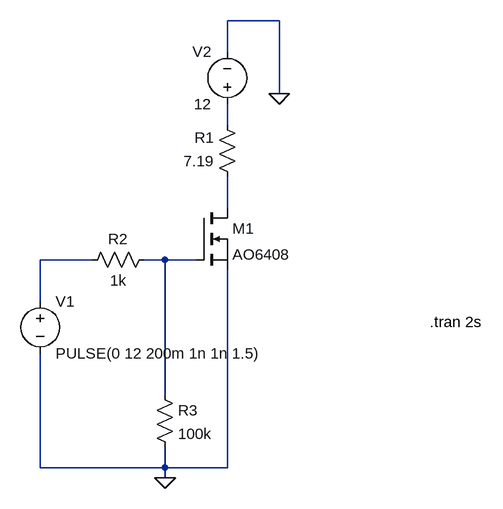
[diagram p0: schematic Valve Controller.asc]
Valve Controller.asc, the LTspice schematic file:
Version 4
SHEET 1 880 680
WIRE 400 -320 320 -320
WIRE 320 -272 320 -320
WIRE 400 -208 400 -320
WIRE 320 -160 320 -192
WIRE 320 -32 320 -80
WIRE 112 48 32 48
WIRE 224 48 192 48
WIRE 272 48 224 48
WIRE 32 112 32 48
WIRE 224 256 224 48
WIRE 32 368 32 192
WIRE 224 368 224 336
WIRE 224 368 32 368
WIRE 320 368 320 64
WIRE 320 368 224 368
WIRE 224 384 224 368
FLAG 224 384 0
FLAG 400 -208 0
SYMBOL voltage 32 96 R0
WINDOW 123 0 0 Left 0
WINDOW 39 0 0 Left 0
SYMATTR InstName V1
SYMATTR Value PULSE(0 12 200m 1n 1n 1.5)
SYMBOL nmos 272 -32 R0
SYMATTR InstName M1
SYMATTR Value AO6408
SYMBOL res 336 -64 R180
WINDOW 0 36 76 Left 2
WINDOW 3 36 40 Left 2
SYMATTR InstName R1
SYMATTR Value 7.19
SYMBOL res 208 32 R90
WINDOW 0 0 56 VBottom 2
WINDOW 3 32 56 VTop 2
SYMATTR InstName R2
SYMATTR Value 1k
SYMBOL res 208 240 R0
SYMATTR InstName R3
SYMATTR Value 100k
SYMBOL voltage 320 -176 R180
WINDOW 0 24 96 Left 2
WINDOW 3 24 16 Left 2
WINDOW 123 0 0 Left 0
WINDOW 39 0 0 Left 0
SYMATTR InstName V2
SYMATTR Value 12
TEXT 632 144 Left 2 !.tran 2s

The netlist it stands for:
* Valve Controller.asc
V1 N003 0 PULSE(0 12 200m 1n 1n 1.5)
M1 N002 N004 0 0 AO6408
R1 N002 N001 7.19
R2 N004 N003 1k
R3 N004 0 100k
V2 N001 0 12
.model NMOS NMOS
.model PMOS PMOS
.lib standard.mos
.tran 2s
.backanno
.end